# EasyEDA Pro project OctoSlime_Haptics_Module.eprj

# Schematic Haptics
Create Date: 2022-07-25; Page Name: P1; Project Name: OctoSlime_Haptics_Module; Schematic Name: Haptics; Update Date: 2022-07-27; Drawed: KeonMan; Part Number: EmbeddedAT_Hap01; Reviewed: KeonMan; Version: 1.0
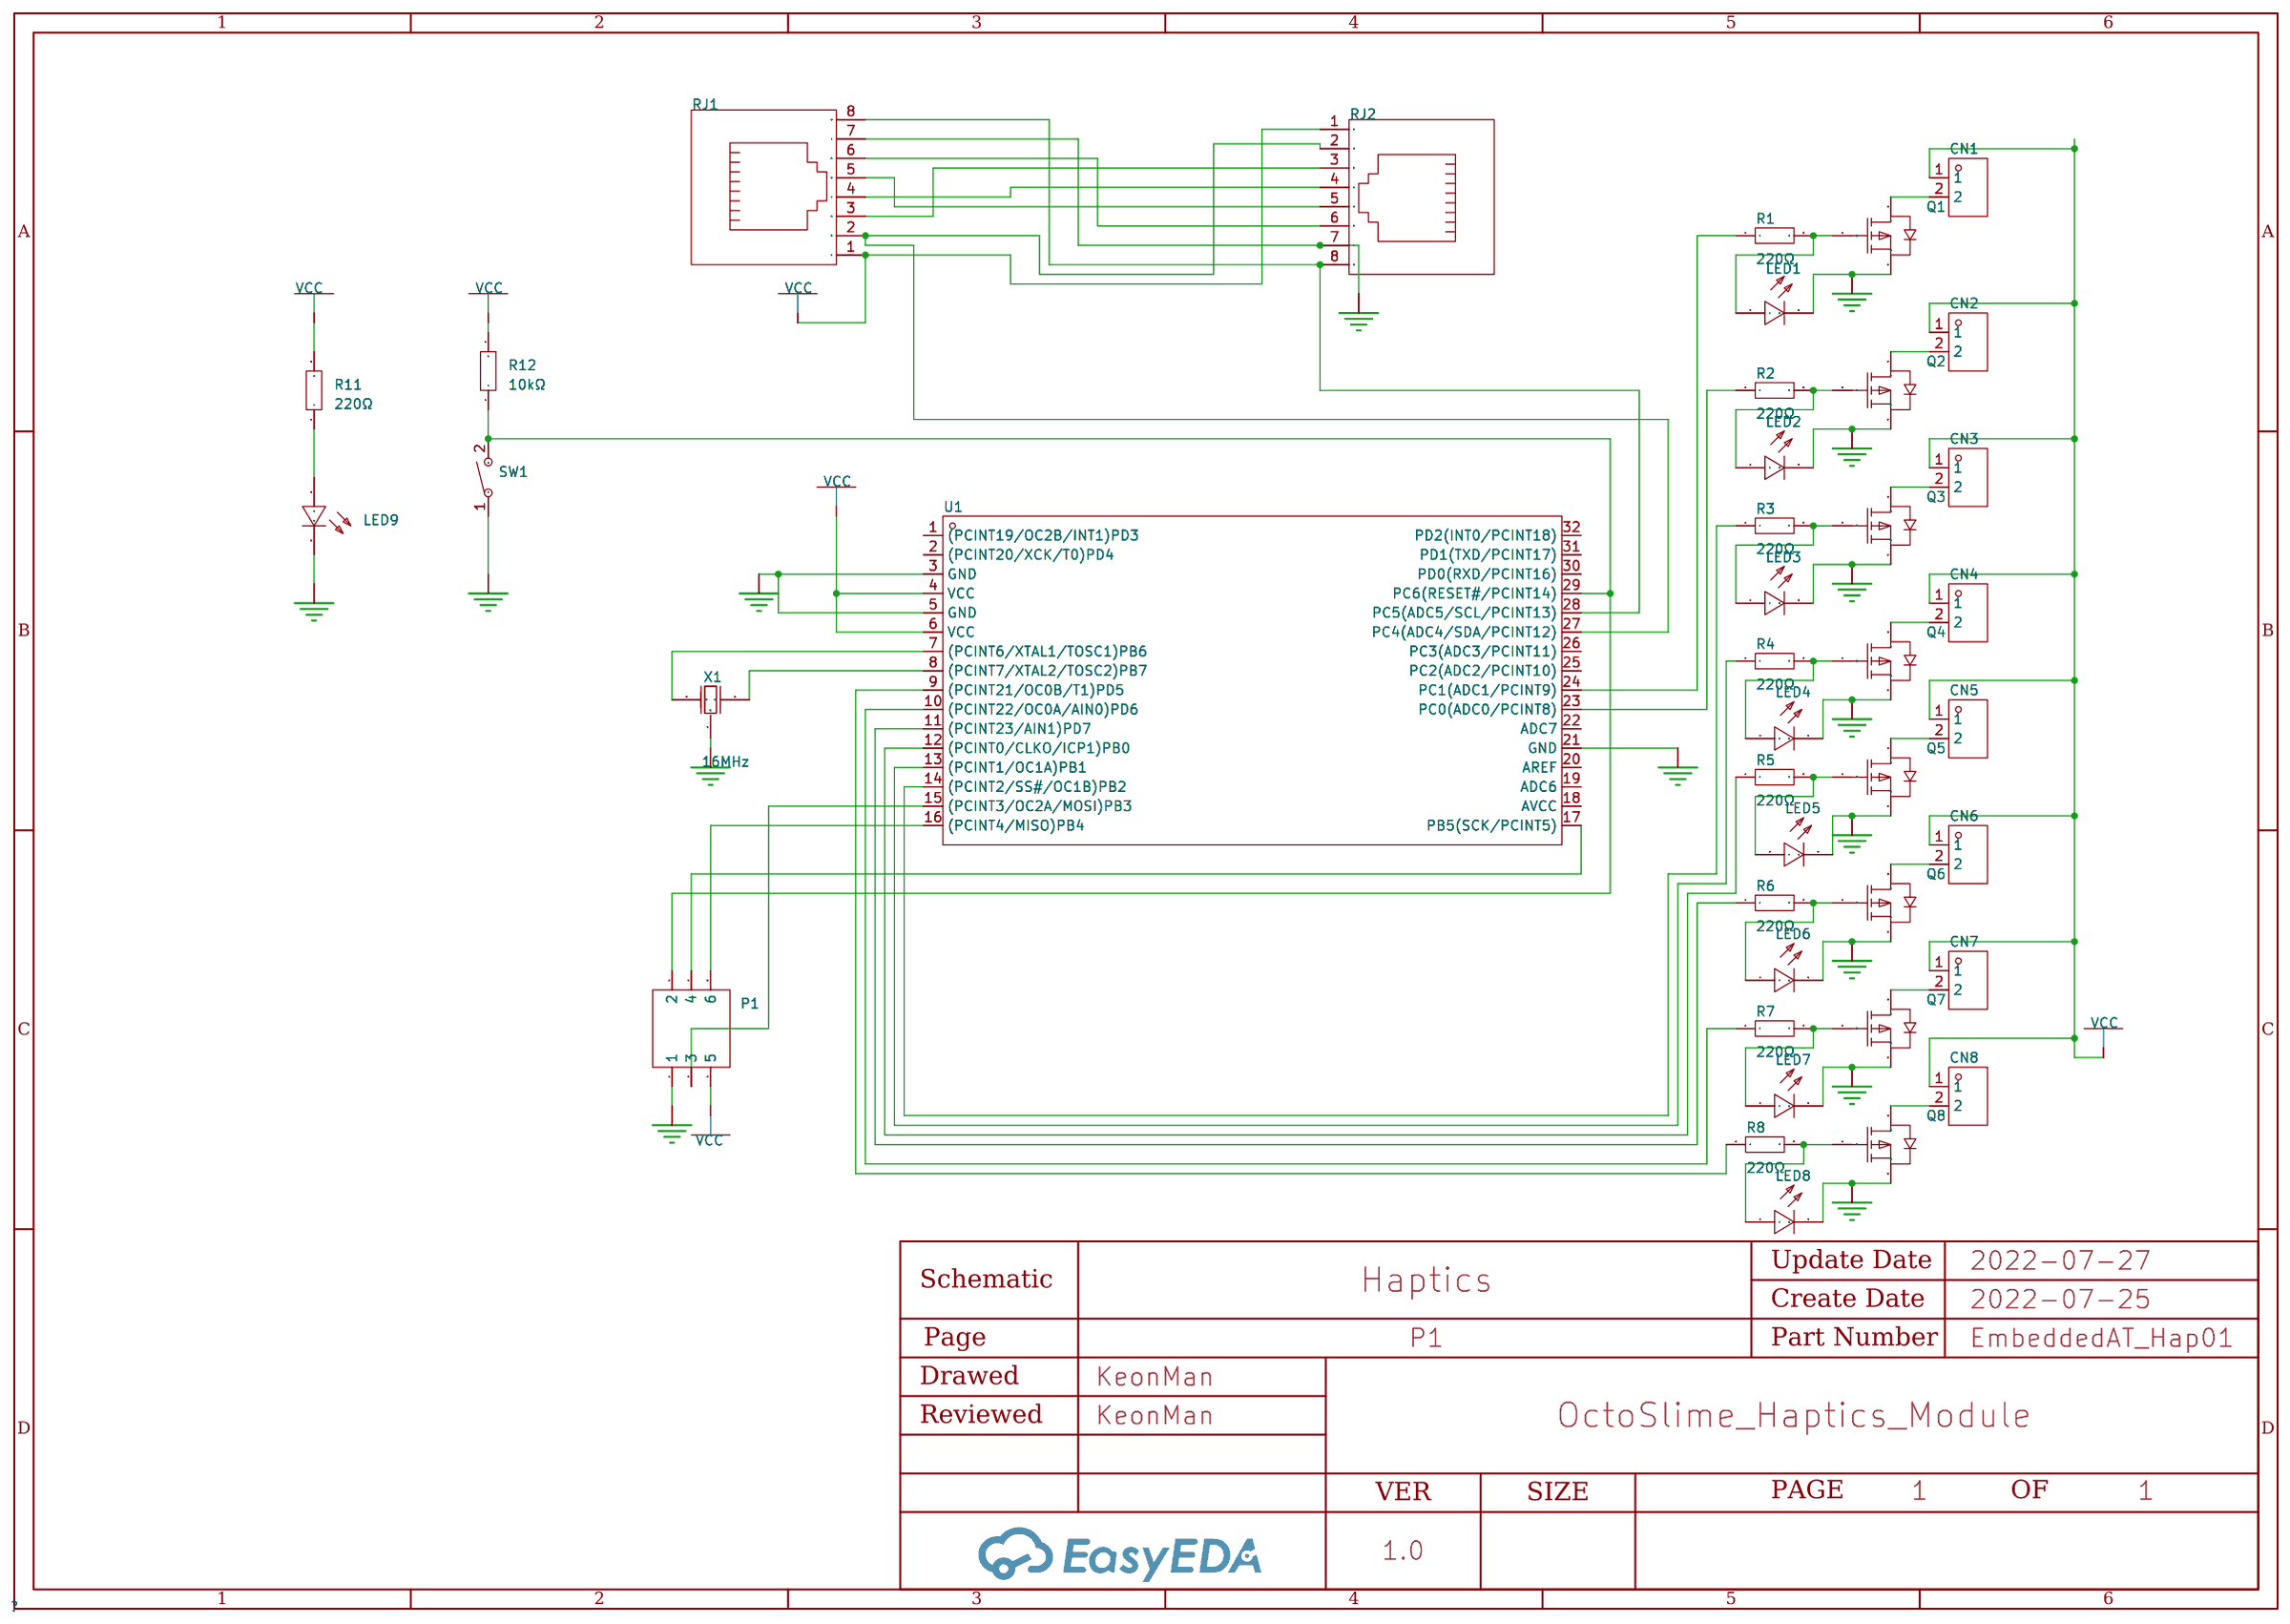
[diagram p0: schematic sheet]

## Parts
CN1  -  [CONN-TH_2P-P2.50_HX25003-2WAP]
CN2  -  [CONN-TH_2P-P2.50_HX25003-2WAP]
CN3  -  [CONN-TH_2P-P2.50_HX25003-2WAP]
CN4  -  [CONN-TH_2P-P2.50_HX25003-2WAP]
CN5  -  [CONN-TH_2P-P2.50_HX25003-2WAP]
CN6  -  [CONN-TH_2P-P2.50_HX25003-2WAP]
CN7  -  [CONN-TH_2P-P2.50_HX25003-2WAP]
CN8  -  [CONN-TH_2P-P2.50_HX25003-2WAP]
LED1  -  [LED0603-R-RD]
LED2  -  [LED0603-R-RD]
LED3  -  [LED0603-R-RD]
LED4  -  [LED0603-R-RD]
LED5  -  [LED0603-R-RD]
LED6  -  [LED0603-R-RD]
LED7  -  [LED0603-R-RD]
LED8  -  [LED0603-R-RD]
LED9  -  [LED0603-R-RD]
P1  -  [IDC-TH_6P-P2.54_C11214]
Q1  -  [SC-70-3_L2.2-W1.2-P1.30-LS2.1-BL]
Q2  -  [SC-70-3_L2.2-W1.2-P1.30-LS2.1-BL]
Q3  -  [SC-70-3_L2.2-W1.2-P1.30-LS2.1-BL]
Q4  -  [SC-70-3_L2.2-W1.2-P1.30-LS2.1-BL]
Q5  -  [SC-70-3_L2.2-W1.2-P1.30-LS2.1-BL]
Q6  -  [SC-70-3_L2.2-W1.2-P1.30-LS2.1-BL]
Q7  -  [SC-70-3_L2.2-W1.2-P1.30-LS2.1-BL]
Q8  -  [SC-70-3_L2.2-W1.2-P1.30-LS2.1-BL]
R1  220Ω  [R1206]
R2  220Ω  [R1206]
R3  220Ω  [R1206]
R4  220Ω  [R1206]
R5  220Ω  [R1206]
R6  220Ω  [R1206]
R7  220Ω  [R1206]
R8  220Ω  [R1206]
R11  220Ω  [R1206]
R12  10kΩ  [R0805]
RJ1  -  [RJ45-TH_R-RJ45R08P-A004]
RJ2  -  [RJ45-TH_R-RJ45R08P-A004]
SW1  -  [SW-SMD_L4.0-W2.9-LS5.0]
U1  -  [TQFP-32_L7.0-W7.0-P0.80-LS9.0-BL]
X1  16MHz  [OSC-SMD_3P-L3.2-W1.3-P1.2-L]

## Library data of the parts
CN1-CN8 = HX25003-2WAP: 俗称： XH2.54 配套：HX25002-2Y; LCSC Part Name: 母座 弯插/弯针 2.5mm 2Pin位; Supplier Part: C442326; Manufacturer: HX(红星); Supplier Footprint: 插件,P=2.5mm; JLCPCB Part Class: Extended Part; Datasheet: https://atta.szlcsc.com/upload/public/pdf/source/20191028/C442326_951D1FF48F4BC139C99E649B2A876D28.pdf; Supplier: LCSC
LED1-LED9 = 19-213/R6C-AP1Q2B/3T: 发光颜色:红灯;; LCSC Part Name: Briliant Red; Supplier Part: C128051; Manufacturer: EVERLIGHT(台湾亿光); Supplier Footprint: 0603; JLCPCB Part Class: Extended Part; Datasheet: https://atta.szlcsc.com/upload/public/pdf/source/20181127/C128051_25A9A75D91D4088C5FF567B51E5BBE72.pdf; Supplier: LCSC; Emitted Color: 红灯
P1 = 2.54-2*3P简牛: 连接器类型:简牛座;间距:2.54mm;排数:2;行距:2.54mm;封装形式:直插;触头材质:黄铜;触头镀层:金;; LCSC Part Name: 2.54mm 排数:2 2*3P; Supplier Part: C11214; Manufacturer: BOOMELE(博穆精密); Supplier Footprint: 插件,P=2.54mm; JLCPCB Part Class: Extended Part; Datasheet: https://atta.szlcsc.com/upload/public/pdf/source/20140331/1457707037652.pdf; Supplier: LCSC; Connector Type: 简牛座; Pitch: 2.54mm; Number of Rows: 2; Row Spacing: 2.54mm; Holder Type: 直插; Contact Material: 黄铜; Contact Plating: 金
Q1-Q8 = CJ2101: 类型:P沟道;漏源电压(Vdss):20V;连续漏极电流(Id):1.4A;功率(Pd):290mW;导通电阻(RDS(on)@Vgs,Id):100mΩ@4.5V,1A;阈值电压(Vgs(th)@Id):700mV@250A;; LCSC Part Name: P沟道 20V 1.4A; Supplier Part: C52641; Manufacturer: CJ（江苏长电/长晶）; Supplier Footprint: SOT-323(SC-70); JLCPCB Part Class: Extended Part; Datasheet: https://atta.szlcsc.com/upload/public/pdf/source/20160713/1468379852203.pdf; Supplier: LCSC; Type: P沟道; Drain Source Voltage (Vdss): 20V; Continuous Drain Current (Id): 1.4A; Power Dissipation (Pd): 290mW; Drain Source On Resistance (RDS(on)@Vgs,Id): 100mΩ@4.5V,1A; Gate Threshold Voltage (Vgs(th)@Id): 700mV@250A
R1-R8 R11 = RC1206FR-07220RL: 电阻类型:厚膜电阻;阻值:220Ω;精度:±1%;功率:250mW;温度系数:±100ppm/;最大工作电压:200V;工作温度范围:-55~+155;; LCSC Part Name: 220Ω ±1%; Supplier Part: C137353; Manufacturer: YAGEO(国巨); Supplier Footprint: 1206; JLCPCB Part Class: Extended Part; Datasheet: https://atta.szlcsc.com/upload/public/pdf/source/20171106/C137353_15099603814611093519.pdf; Supplier: LCSC; Type: 厚膜电阻; Tolerance: ±1%; Power(Watts): 250mW; Temperature Coefficient: ±100ppm/; Overload Voltage (Max): 200V; Operating Temperature Range: -55~+155
R12 = RMCF0805FT10K0: 电阻类型:厚膜电阻;阻值:10kΩ;精度:±1%;功率:125mW;温度系数:-;最大工作电压:150V;工作温度范围:-55~+125;; LCSC Part Name: 10kΩ ±1%; Supplier Part: C237755; Manufacturer: SEI(Stackpole Electronics Inc.); Supplier Footprint: 0805; JLCPCB Part Class: Extended Part; Datasheet: https://atta.szlcsc.com/upload/public/pdf/source/20181205/C237755_30FA738726C69E37C86821B0BDD56A4F.pdf; Supplier: LCSC; Type: 厚膜电阻; Tolerance: ±1%; Power(Watts): 125mW; Overload Voltage (Max): 150V; Operating Temperature Range: -55~+125
RJ1 RJ2 = R-RJ45R08P-A004: 连接器类型:RJ插座;USOC代码:RJ45;端口数量:1;等级:-;安装方式:弯插;屏蔽:无;LED:无;工作温度范围:0~+70;; LCSC Part Name: RJ45 8P/8C 全塑 无灯; Supplier Part: C385834; Manufacturer: Ckmtw(灿科盟); Supplier Footprint: 插件; JLCPCB Part Class: Extended Part; Datasheet: https://atta.szlcsc.com/upload/public/pdf/source/20210127/C385834_05A472B070A4DC4A7A2338A5364B5FF5.pdf; Supplier: LCSC; Connector Type: RJ插座; USOC Codes: RJ45; Number of Ports: 1; Mounting Style: 弯插; Shielding: 无; LED: 无; Operating Temperature Range: 0~+70
SW1 = TS342A2P-WZ: LCSC Part Name: 轻触开关 3*4*2 两脚小龟不带柱 250gf 黑色塑胶按钮; Supplier Part: C557591; Manufacturer: SHOU HAN(首韩); Supplier Footprint: SMD; JLCPCB Part Class: Extended Part; Datasheet: https://atta.szlcsc.com/upload/public/pdf/source/20200519/C557591_B3A5A21584733303F06306F18577DA8B.pdf; Supplier: LCSC
U1 = ATMEGA328P-AU: CPU内核:AVR;主频（MAX):20MHz;工作电压:1.8V ~ 5.5V;; Supplier Part: C14877; Manufacturer: MICROCHIP(美国微芯); Supplier Footprint: TQFP-32_7x7x08P; JLCPCB Part Class: Basic Part; Datasheet: https://atta.szlcsc.com/upload/public/pdf/source/20140621/1457707095197.pdf; Supplier: LCSC; Core Processor: AVR; Speed: 20MHz; Voltage - Supply (Vcc/Vdd): 1.8V ~ 5.5V; Program Memory Size: 32KB (16W); RAM Size: 2KB; EEPROM Size: 1KB; Number of I/O: 23; A/D: 8x10bit; PWM: 6
X1 = CSTNE16M0V530000R0: 频率:16MHz;频率容差:±0.5%;内藏负载电容:15pF;谐振阻抗:40Ω;; LCSC Part Name: 16MHz ±0.5% 15pF; Supplier Part: C341521; Manufacturer: muRata(村田); Supplier Footprint: SMD3213-3P; JLCPCB Part Class: Extended Part; Datasheet: https://atta.szlcsc.com/upload/public/pdf/source/20181211/C341521_3DF77211002AAEDE8E1FD920A512C1E4.pdf; Supplier: LCSC; Frequency Stability: ±0.3%; Frequency Tolerance: ±0.5%; Built-in Load Capacitance: 15pF; Resonant Impedance: 40Ω; Operating Temperature: -40~+85

## Nets
GND: LED1.2(C) LED2.2(C) LED3.2(C) LED4.2(C) LED5.2(C) LED6.2(C) LED7.2(C) LED8.2(C) LED9.2(C) P1.1 Q1.2(S) Q2.2(S) Q3.2(S) Q4.2(S) Q5.2(S) Q6.2(S) Q7.2(S) Q8.2(S) RJ1.7 RJ2.7 SW1.1 U1.3(GND) U1.5(GND) U1.21(GND) X1.2(GND)
VCC: CN1.1 CN2.1 CN3.1 CN4.1 CN5.1 CN6.1 CN7.1 CN8.1 P1.5 R11.2 R12.2 RJ1.1 RJ2.1 U1.4(VCC) U1.6(VCC)
$1N5111: U1.7((PCINT6/XTAL1/TOSC1)PB6) X1.3(OSC2)
$1N5116: U1.8((PCINT7/XTAL2/TOSC2)PB7) X1.1(OSC1)
$1N6218: LED1.1(A) Q1.1(G) R1.2
$1N6231: LED2.1(A) Q2.1(G) R2.2
$1N6244: LED3.1(A) Q3.1(G) R3.2
$1N6257: LED4.1(A) Q4.1(G) R4.2
$1N6270: LED5.1(A) Q5.1(G) R5.2
$1N6283: LED6.1(A) Q6.1(G) R6.2
$1N6296: LED7.1(A) Q7.1(G) R7.2
$1N6309: LED8.1(A) Q8.1(G) R8.2
$1N6625: R8.1 U1.9((PCINT21/OC0B/T1)PD5)
$1N6658: R7.1 U1.10((PCINT22/OC0A/AIN0)PD6)
$1N6846: R6.1 U1.11((PCINT23/AIN1)PD7)
$1N6868: R5.1 U1.12((PCINT0/CLKO/ICP1)PB0)
$1N6892: R4.1 U1.13((PCINT1/OC1A)PB1)
$1N6918: R3.1 U1.14((PCINT2/SS#/OC1B)PB2)
$1N6980: R2.1 U1.23(PC0(ADC0/PCINT8))
$1N6998: R1.1 U1.24(PC1(ADC1/PCINT9))
$1N7095: RJ1.8 RJ2.8 U1.28(PC5(ADC5/SCL/PCINT13))
$1N7131: RJ1.6 RJ2.6
$1N7215: RJ1.5 RJ2.5
$1N7233: RJ1.4 RJ2.4
$1N7251: RJ1.3 RJ2.3
$1N7415: RJ1.2 RJ2.2 U1.27(PC4(ADC4/SDA/PCINT12))
$1N8119: CN1.2 Q1.3(D)
$1N8137: CN2.2 Q2.3(D)
$1N8155: CN3.2 Q3.3(D)
$1N8173: CN4.2 Q4.3(D)
$1N8191: CN5.2 Q5.3(D)
$1N8209: CN6.2 Q6.3(D)
$1N8391: CN7.2 Q7.3(D)
$1N8408: CN8.2 Q8.3(D)
Net-(LED9-1): LED9.1(A) R11.1
Net-(P1-2): P1.2 R12.1 SW1.2 U1.29(PC6(RESET#/PCINT14))
Net-(P1-3): P1.3 U1.15((PCINT3/OC2A/MOSI)PB3)
Net-(P1-4): P1.4 U1.17(PB5(SCK/PCINT5))
Net-(P1-6): P1.6 U1.16((PCINT4/MISO)PB4)

Not connected (* = marked no-connect by the designer): U1 1((PCINT19/OC2B/INT1)PD3) 2((PCINT20/XCK/T0)PD4) 18(AVCC) 19(ADC6) 20(AREF) 22(ADC7) 25(PC2(ADC2/PCINT10)) 26(PC3(ADC3/PCINT11)) 30(PD0(RXD/PCINT16)) 31(PD1(TXD/PCINT17)) 32(PD2(INT0/PCINT18))

# Board PCB1
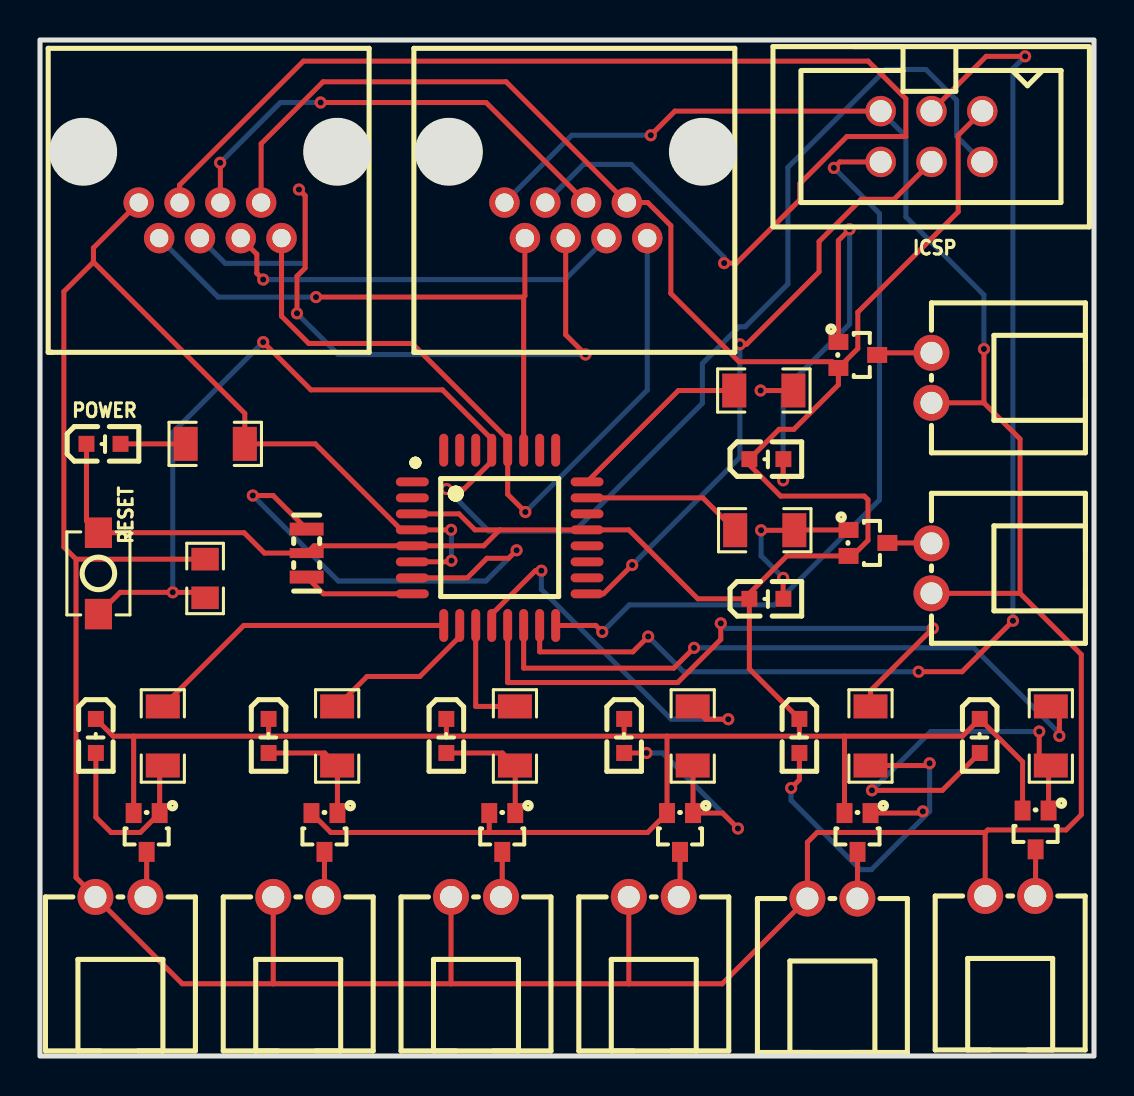
[diagram p1: board, top side]
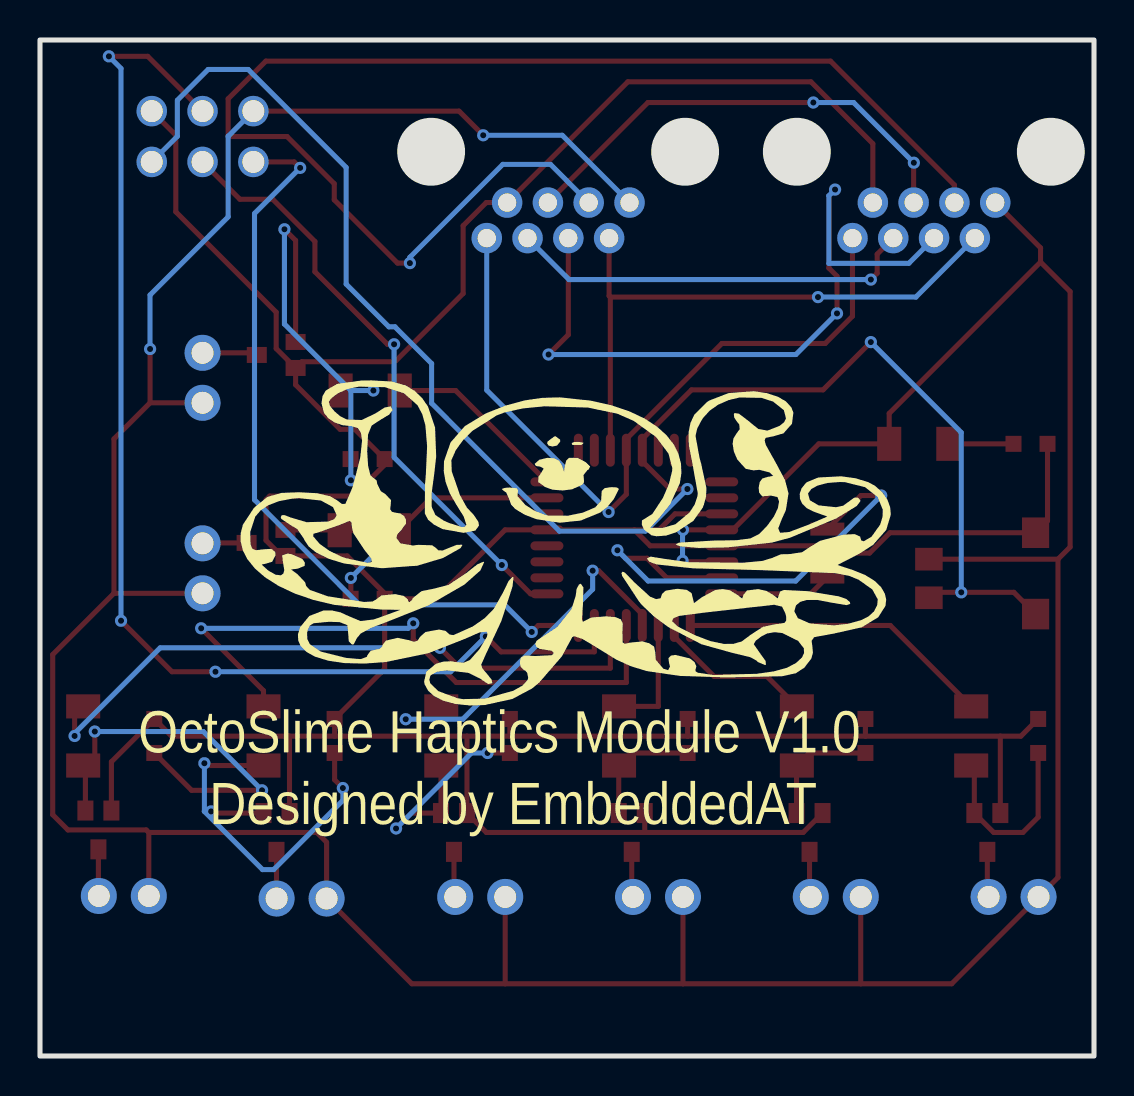
[diagram p2: board, bottom side, seen from below]

Outline 52.7 x 50.8 mm; copper layers: Top Layer, Bottom Layer. Coordinates in mm from the lower left corner of the outline.
Outline path: rectangle 0,50.8 52.7,0
Stack: Top Layer 0.035mm / Dielectric1 1.51mm FR4 er 4.5 / Bottom Layer 0.035mm

## Design rules (mm)
spacing safeClearance (default): track to track 0.152, other pairs 0.152 to 0.3
track width trackWidth (default): min 0.127, default 0.254, max 2.54
differential pair differentialPair (default): width min 0.127, default 0.254, max 2.54; gap min 0.152, default 0.152
via viaSize (default): diameter min 0.5, default 0.61, max 10; hole min 0.3, default 0.305, max 6

## Placement (name value [footprint] x y rotation side)
CN1  -  [CONN-TH_2P-P2.50_HX25003-2WAP]  44.58 33.91 90 top
CN2  -  [CONN-TH_2P-P2.50_HX25003-2WAP]  44.58 24.38 90 top
CN3  -  [CONN-TH_2P-P2.50_HX25003-2WAP]  48.51 8 0 top
CN4  -  [CONN-TH_2P-P2.50_HX25003-2WAP]  39.62 7.87 0 top
CN5  -  [CONN-TH_2P-P2.50_HX25003-2WAP]  30.69 7.95 0 top
CN6  -  [CONN-TH_2P-P2.50_HX25003-2WAP]  21.8 7.95 0 top
CN7  -  [CONN-TH_2P-P2.50_HX25003-2WAP]  12.91 7.95 0 top
CN8  -  [CONN-TH_2P-P2.50_HX25003-2WAP]  4.02 7.95 0 top
ICSP  -  [IDC-TH_6P-P2.54_C11214]  44.58 45.97 180 top
LED1  -  [LED0603-R-RD]  36.32 29.84 0 top
LED2  -  [LED0603-R-RD]  36.32 22.86 0 top
LED3  -  [LED0603-R-RD]  46.99 16 270 top
LED4  -  [LED0603-R-RD]  37.97 16 270 top
LED5  -  [LED0603-R-RD]  29.21 16 270 top
LED6  -  [LED0603-R-RD]  20.32 16 270 top
LED7  -  [LED0603-R-RD]  11.43 16 270 top
LED8  -  [LED0603-R-RD]  2.79 16 270 top
POWER  -  [LED0603-R-RD]  3.18 30.61 0 top
Q1  -  [SC-70-3_L2.2-W1.2-P1.30-LS2.1-BL]  40.89 35.05 270 top
Q2  -  [SC-70-3_L2.2-W1.2-P1.30-LS2.1-BL]  41.4 25.65 270 top
Q3  -  [SC-70-3_L2.2-W1.2-P1.30-LS2.1-BL]  49.78 11.3 180 top
Q4  -  [SC-70-3_L2.2-W1.2-P1.30-LS2.1-BL]  40.88 11.18 180 top
Q5  -  [SC-70-3_L2.2-W1.2-P1.30-LS2.1-BL]  32 11.18 180 top
Q6  -  [SC-70-3_L2.2-W1.2-P1.30-LS2.1-BL]  23.11 11.18 180 top
Q7  -  [SC-70-3_L2.2-W1.2-P1.30-LS2.1-BL]  14.22 11.18 180 top
Q8  -  [SC-70-3_L2.2-W1.2-P1.30-LS2.1-BL]  5.33 11.18 180 top
R1  220Ω  [R1206]  36.2 33.27 0 top
R2  220Ω  [R1206]  36.24 26.29 0 top
R3  220Ω  [R1206]  50.55 16 270 top
R4  220Ω  [R1206]  41.53 16 270 top
R5  220Ω  [R1206]  32.64 16 270 top
R6  220Ω  [R1206]  23.75 16 270 top
R7  220Ω  [R1206]  14.86 16 270 top
R8  220Ω  [R1206]  6.14 16 270 top
R11  220Ω  [R1206]  8.76 30.61 0 top
R12  10kΩ  [R0805]  8.26 23.88 90 top
RESET  -  [SW-SMD_L4.0-W2.9-LS5.0]  2.92 24.13 270 top
RJ1  -  [RJ45-TH_R-RJ45R08P-A004]  26.8 41.78 180 top
RJ2  -  [RJ45-TH_R-RJ45R08P-A004]  8.51 41.78 180 top
U1  -  [TQFP-32_L7.0-W7.0-P0.80-LS9.0-BL]  22.99 25.91 270 top
X1  16MHz  [OSC-SMD_3P-L3.2-W1.3-P1.2-L]  13.33 25.15 90 top

## Footprints (pads in the part's own frame, mm; a bottom-side part is the same pattern mirrored in y, then rotated)
CONN-TH_2P-P2.50_HX25003-2WAP
  round 1.801 hole 1.1: 1(-1.25,0) 2(1.25,0)
IDC-TH_6P-P2.54_C11214
  round 1.524 hole 1.1: 1(-2.54,-1.27) 2(-2.54,1.27) 3(0,-1.27) 4(0,1.27) 5(2.54,-1.27) 6(2.54,1.27)
LED0603-R-RD
  rect 0.8x0.8 smd: 1(0.851,0) 2(-0.851,0)
OSC-SMD_3P-L3.2-W1.3-P1.2-L
  rect 0.65x1.7 smd: 1(-1.199,0) 3(1.199,0)
  rect 0.5x1.7 smd: 2(0,0)
R0805
  rect 1.133x1.377 smd: 1(-0.965,0) 2(0.965,0)
R1206
  rect 1.206x1.702 smd: 1(-1.478,0) 2(1.478,0)
RJ45-TH_R-RJ45R08P-A004
  round 1.524 hole 0.914: 1(3.571,-0.889) 2(2.55,0.889) 3(1.529,-0.889) 4(0.51,0.889) 5(-0.51,-0.889) 6(-1.529,0.889) 7(-2.55,-0.889) 8(-3.568,0.889)
SC-70-3_L2.2-W1.2-P1.30-LS2.1-BL
  rect 0.8x1.001 smd: 1(-0.65,-0.971) 2(0.65,-0.971) 3(0,0.971)
SW-SMD_L4.0-W2.9-LS5.0
  rect 1.529x1.359 smd: 1(-2.034,0) 2(2.034,0)
TQFP-32_L7.0-W7.0-P0.80-LS9.0-BL
  oval 0.45x1.651 smd: 1(-2.799,-4.369) 2(-1.999,-4.369) 3(-1.199,-4.369) 4(-0.399,-4.369) 5(0.399,-4.369) 6(1.199,-4.369) 7(1.999,-4.369) 8(2.799,-4.369) 17(2.799,4.369) 18(1.999,4.369) 19(1.199,4.369) 20(0.399,4.369) 21(-0.399,4.369) 22(-1.199,4.369) 23(-1.999,4.369) 24(-2.799,4.369)
  oval 1.651x0.45 smd: 9(4.381,-2.799) 10(4.381,-1.999) 11(4.381,-1.199) 12(4.381,-0.399) 13(4.381,0.399) 14(4.381,1.199) 15(4.381,1.999) 16(4.381,2.799) 25(-4.381,2.799) 26(-4.381,1.999) 27(-4.381,1.199) 28(-4.381,0.399) 29(-4.381,-0.399) 30(-4.381,-1.199) 31(-4.381,-1.999) 32(-4.381,-2.799)

## Nets
As in the schematic, except:
GND: ICSP.1 LED1.2 LED2.2 LED3.2 LED4.2 LED5.2 LED6.2 LED7.2 LED8.2 POWER.2 Q1.2 Q2.2 Q3.2 Q4.2 Q5.2 Q6.2 Q7.2 Q8.2 RESET.1 RJ1.7 RJ2.7 U1.3 U1.5 U1.21 X1.2
VCC: CN1.1 CN2.1 CN3.1 CN4.1 CN5.1 CN6.1 CN7.1 CN8.1 ICSP.5 R11.2 R12.2 RJ1.1 RJ2.1 U1.4 U1.6
$1N10865: ICSP.6 U1.16
$1N10972: ICSP.4 U1.17
$1N11114: ICSP.2 R12.1 RESET.2 U1.29
$1N11268: ICSP.3 U1.15
$1N21722: POWER.1 R11.1

Pads without a net: U1 1 2 18 19 20 22 25 26 30 31 32

## Via types
v1: diameter 0.61, hole 0.305, Top Layer to Bottom Layer, 44 vias

## Routing (per net, layer and track width the routed paths; a pad name or vN(x,y) marks a point on that pad's centre or on a via; arc(x,y) is an arc through that point)
GND: length 216.2
  Top Layer w0.254: 22.46,11.18 Q6.2 ; 22.46,11.18 14.54,11.18 Q7.2 ; 22.46,11.18 30.38,11.18 Q5.2 31.35,15.99 ; 40.23,15.99 46.13,15.99 LED3.2 49.13,14.71 Q3.2 ; 40.23,15.99 Q4.2 ; 40.23,15.99 37.97,15.99 ; Q1.2 39.92,33.56 37.7,31.33 36.96,31.33 LED1.2 35.47,29.56 37.03,28 41.22,28 41.4,27.81 41.4,25.78 40.63,25 37.34,25 35.47,23.13 LED2.2 ; Q1.2 39.61,34.71 34.96,34.71 31.55,38.12 31.55,41.52 30.39,42.67 RJ1.7 23.31,48.71 14.15,48.71 11.06,45.61 RJ2.7 ; Q1.2 40.89,35.37 40.89,37.19 45.91,42.21 45.91,46.04 ICSP.1 ; 20.32,15.99 11.43,15.99 ; 20.32,15.99 LED6.2 ; 20.32,15.99 29.21,15.99 ; 11.43,15.99 LED7.2 ; 11.43,15.99 4.68,15.99 ; LED8.2 3.66,15.99 4.68,15.99 ; 37.97,15.99 31.35,15.99 ; 37.97,15.99 LED4.2 35.47,19.36 LED2.2 ; 31.35,15.99 29.21,15.99 ; 22.99,26.31 U1.21 29.45,26.31 32.89,22.86 LED2.2 ; 22.99,26.31 22.19,25.51 U1.5 13.7,25.51 X1.2 11.22,25.15 10.2,26.16 RESET.1 2.32,26.76 POWER.2 ; 22.99,26.31 21.75,26.31 20.95,27.11 U1.3 ; 29.21,15.99 LED5.2 ; Q8.2 4.68,15.99
VCC: length 210.8
  Top Layer w0.254: 49.01,23.13 CN2.1 ; 49.01,23.13 52.07,20.07 52.07,12.06 51.31,11.3 47.39,11.3 47.26,11.18 ; 49.01,23.13 49.01,30.85 47.2,32.66 ; 20.55,3.61 CN6.1 ; 20.55,3.61 29.44,3.61 ; 20.55,3.61 11.66,3.61 ; 47.2,32.66 CN1.1 ; 47.2,32.66 v1(47.2,35.35) ; ICSP.5 31.75,47.24 v1(30.54,46.04) ; 29.44,3.61 34.11,3.61 CN4.1 38.37,10.69 38.86,11.18 47.26,11.18 ; 29.44,3.61 CN5.1 ; 2.67,39.7 10.24,32.13 R11.2 13.76,30.61 18.06,26.31 U1.4 v1(20.56,26.31) 20.57,26.29 ; 2.67,39.7 2.67,40.41 RJ2.1 ; 2.67,39.7 1.19,38.22 1.19,25.45 1.8,24.84 ; U1.6 20.52,24.71 v1(20.57,24.77) ; 47.26,11.18 CN3.1 ; 1.8,24.84 1.8,8.92 CN8.1 7.12,3.61 11.66,3.61 ; 1.8,24.84 R12.2 ; 11.66,3.61 CN7.1
  Bottom Layer w0.254: v1(30.54,46.04) 26.59,46.04 RJ1.1 ; v1(20.57,24.77) 20.57,26.29 v1(20.56,26.31) ; v1(47.2,35.35) 47.2,38.05 43.3,41.96 43.3,45.98 ICSP.5
$1N5111: length 24.8
  Top Layer w0.254: v1(10.64,28.02) 11.66,28.02 X1.3 ; v1(23.83,25.29) 23.43,24.89 22.35,24.89 21.37,23.91 U1.7
  Bottom Layer w0.254: v1(10.64,28.02) 14.92,23.75 22.29,23.75 v1(23.83,25.29)
$1N5116: length 5.6
  Top Layer w0.254: U1.8 14.17,23.11 X1.1
$1N6218: length 23.6
  Top Layer w0.254: 39.92,35.7 39.92,40.78 v1(40.48,41.34) ; v1(37.16,28.78) 37.16,29.83 LED1.1 ; v1(36.03,33.27) R1.2
  Bottom Layer w0.254: v1(40.48,41.34) 40.48,36.6 37.16,33.27 ; 37.16,33.27 v1(37.16,28.78) ; 37.16,33.27 v1(36.03,33.27)
$1N6231: length 8.3
  Top Layer w0.254: Q2.1 37.73,26.3 R2.2 ; 37.72,26.29 v1(36.06,26.29) ; LED2.1 37.16,22.87 v1(37.16,23.9)
  Bottom Layer w0.254: v1(36.06,26.29) 36.06,25.01 v1(37.16,23.9)
$1N6244: length 20
  Top Layer w0.254: v1(49.97,16.22) 49.97,14.99 50.43,14.52 ; v1(41.6,13.28) 45.12,13.28 LED3.1 ; 50.43,14.52 R3.2 ; 50.43,14.52 Q3.1
  Bottom Layer w0.254: v1(41.6,13.28) 44.54,16.22 v1(49.97,16.22)
$1N6257: length 20.5
  Top Layer w0.254: LED4.1 37.97,13.81 v1(37.56,13.4) ; v1(44.15,12.23) 44.06,12.15 Q4.1 ; v1(44.48,14.64) 44.37,14.52 R4.2
  Bottom Layer w0.254: 44.48,12.23 v1(44.15,12.23) ; 44.48,12.23 v1(44.48,14.64) ; 44.48,12.23 41.57,9.32 41.02,9.32 37.56,12.78 v1(37.56,13.4)
$1N6270: length 12.2
  Top Layer w0.254: v1(34.9,11.38) 34.13,12.15 Q5.1 32.65,14.51 R5.2 ; v1(30.33,15.15) LED5.1
  Bottom Layer w0.254: v1(34.9,11.38) 31.13,15.15 v1(30.33,15.15)
$1N6283: length 6.1
  Top Layer w0.254: Q6.1 23.76,14.51 23.12,15.15 LED6.1
$1N6296: length 6.1
  Top Layer w0.254: Q7.1 14.87,14.51 14.23,15.15 LED7.1
$1N6309: length 9.6
  Top Layer w0.254: LED8.1 2.79,11.94 3.56,11.18 5.01,11.18 Q8.1 5.98,14.37 R8.2
$1N6625: length 15.7
  Top Layer w0.254: U1.9 10.19,21.53 R8.1
$1N6658: length 8.1
  Top Layer w0.254: R7.1 16.36,18.98 18.99,18.98 20.99,20.97 U1.10
$1N6846: length 6
  Top Layer w0.254: U1.11 21.79,17.48 R6.1
$1N6868: length 19
  Top Layer w0.254: v1(25.07,24.27) 24.77,24.27 22.59,22.08 U1.12 ; v1(34.42,16.84) 33.28,16.84 R5.1
  Bottom Layer w0.254: v1(25.07,24.27) 25.07,23.33 31.56,16.84 v1(34.42,16.84)
$1N6892: length 31.1
  Top Layer w0.254: v1(44.65,21.38) 41.53,18.27 R4.1 ; v1(34.04,21.63) 34.04,20.83 31.89,18.67 23.39,18.67 U1.13
  Bottom Layer w0.254: v1(34.04,21.63) 34.29,21.38 v1(44.65,21.38)
$1N6918: length 32.9
  Top Layer w0.254: v1(32.71,20.41) 31.69,19.39 24.19,19.39 24.19,21.53 ; R3.1 50.97,17.05 v1(50.97,16)
  Bottom Layer w0.254: v1(50.97,16) 50.97,16.13 46.7,20.41 v1(32.71,20.41)
$1N6980: length 8.1
  Top Layer w0.254: U1.23 33.14,27.91 34.76,26.29
$1N6998: length 9.3
  Top Layer w0.254: U1.24 31.92,33.27 R1.1
$1N7095: length 38
  Top Layer w0.254: v1(24.27,27.2) 23.39,28.09 23.39,30.85 18.61,35.63 13.44,35.63 12.08,36.99 RJ2.8
  Bottom Layer w0.254: RJ1.8 30.37,33.29 v1(24.27,27.2)
$1N7131: length 20.6
  Top Layer w0.254: RJ2.6 10.84,40.09 10.84,39.14 v1(11.16,38.82)
  Bottom Layer w0.254: v1(11.16,38.82) 26.25,38.82 RJ1.6
$1N7215: length 23.6
  Top Layer w0.254: RJ1.5 22.3,47.67 v1(14.03,47.67) ; v1(9.01,44.66) 9.02,44.65 RJ2.5
  Bottom Layer w0.254: v1(9.01,44.66) 12.02,47.67 v1(14.03,47.67)
$1N7233: length 37.6
  Top Layer w0.254: v1(12.85,37.13) 12.85,38.99 13.26,39.4 13.26,43.01 v1(12.95,43.32) ; RJ1.4 26.29,36.06 v1(27.28,35.07)
  Bottom Layer w0.254: RJ2.4 9.26,39.63 13.26,39.63 13.26,43.01 v1(12.95,43.32) ; v1(12.85,37.13) 14.91,35.07 v1(27.28,35.07)
$1N7251: length 66.6
  Top Layer w0.254: RJ2.3 6.98,43.55 13.18,49.74 41.41,49.74 43.3,47.86 43.3,45.97 40.35,45.97 37.99,43.61 37.99,42.81 34.83,39.64 v1(34.21,39.64)
  Bottom Layer w0.254: RJ1.3 27.18,44.58 29.56,44.58 34.21,39.93 v1(34.21,39.64)
$1N7415: length 30.1
  Top Layer w0.254: v1(13.8,37.95) 24.19,37.95 ; 24.19,37.95 24.19,30.29 ; 24.19,37.95 24.25,38.01 RJ1.2
  Bottom Layer w0.254: RJ2.2 8.91,37.95 v1(13.8,37.95)
$1N8119: length 2.8
  Top Layer w0.254: CN1.2 41.97,35.16 Q1.3
$1N8137: length 2.2
  Top Layer w0.254: Q2.3 44.56,25.65 CN2.2
$1N8155: length 2.3
  Top Layer w0.254: CN3.2 49.78,8.02 Q3.3
$1N8173: length 2.3
  Top Layer w0.254: Q4.3 40.88,7.88 CN4.2
$1N8191: length 2.3
  Top Layer w0.254: CN5.2 32,8.02 Q5.3
$1N8209: length 2.3
  Top Layer w0.254: CN6.2 23.11,8.02 Q6.3
$1N8391: length 2.3
  Top Layer w0.254: CN7.2 14.22,8.02 Q7.3
$1N8408: length 2.3
  Top Layer w0.254: Q8.3 5.33,8.02 CN8.2
$1N10865: length 39.1
  Top Layer w0.254: v1(28.12,21.2) 27.79,21.53 U1.16 ; ICSP.6 40,44.7 v1(39.7,44.41)
  Bottom Layer w0.254: v1(28.12,21.2) 29.47,22.56 36.73,22.56 41.98,27.81 41.98,42.12 v1(39.7,44.41)
$1N10972: length 30.4
  Top Layer w0.254: v1(29.61,24.55) 28.17,23.11 U1.17 ; ICSP.4 42.71,42.84 41.07,42.84 38.96,40.73 38.96,39.21 35.33,35.59 v1(35,35.59)
  Bottom Layer w0.254: v1(35,35.59) 35,29.94 v1(29.61,24.55)
$1N11114: length 82.4
  Top Layer w0.254: RESET.2 4.01,23.18 v1(6.64,23.18) 7.98,23.18 R12.1 ; v1(20.33,28.35) 21.2,28.35 22.59,29.73 22.59,30.84 20.13,33.31 13.55,33.31 v1(11.16,35.7)
  Bottom Layer w0.254: ICSP.2 45.84,45.98 45.84,47.79 44.3,49.33 42.3,49.33 37.4,44.43 37.4,38.6 35.26,36.46 34.96,36.46 33.12,34.62 33.12,32.64 26.73,26.24 22.44,26.24 v1(20.33,28.35) ; v1(6.64,23.18) 6.64,31.17 v1(11.16,35.7)
$1N11268: length 61.4
  Top Layer w0.254: ICSP.3 47.32,49.98 v1(49.26,49.98) ; U1.15 24.99,20.21 29.65,20.21 v1(30.41,20.97) ; v1(43.93,19.21) 46.1,19.21 v1(48.65,21.76)
  Bottom Layer w0.254: v1(48.65,21.76) 48.65,49.38 v1(49.26,49.98) ; v1(43.93,19.21) 32.17,19.21 v1(30.41,20.97)
$1N21722: length 3.3
  Top Layer w0.254: POWER.1 R11.1

## Text on the board
Bottom Silkscreen Layer: OctoSlime Haptics Module V1.0 / Designed by EmbeddedAT
